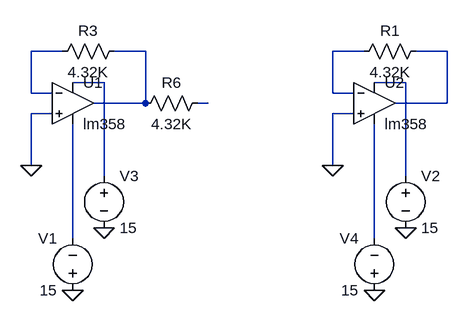
[diagram p0: schematic Inverting_Adder_and_Buffer_Amplifier.asc]
Inverting_Adder_and_Buffer_Amplifier.asc, the LTspice schematic file:
Version 4
SHEET 1 880 680
WIRE 64 -112 16 -112
WIRE 192 -112 144 -112
WIRE 528 -112 480 -112
WIRE 656 -112 608 -112
WIRE 128 -64 80 -64
WIRE 592 -64 544 -64
WIRE 16 -48 16 -112
WIRE 48 -48 16 -48
WIRE 480 -48 480 -112
WIRE 512 -48 480 -48
WIRE 192 -32 192 -112
WIRE 192 -32 112 -32
WIRE 288 -32 272 -32
WIRE 656 -32 656 -112
WIRE 656 -32 576 -32
WIRE 48 -16 16 -16
WIRE 512 -16 480 -16
WIRE 16 64 16 -16
WIRE 480 64 480 -16
WIRE 128 80 128 -64
WIRE 592 80 592 -64
WIRE 80 176 80 0
WIRE 544 176 544 0
FLAG 16 64 0
FLAG 80 256 0
FLAG 128 160 0
FLAG 480 64 0
FLAG 544 256 0
FLAG 592 160 0
SYMBOL OpAmps\\lm358 80 -96 R0
SYMATTR InstName U1
SYMBOL res 160 -128 R90
WINDOW 0 0 56 VBottom 2
WINDOW 3 32 56 VTop 2
SYMATTR InstName R3
SYMATTR Value 4.32K
SYMATTR SpiceLine tol=1 pwr=0.1
SYMBOL voltage 128 64 R0
WINDOW 123 0 0 Left 0
WINDOW 39 0 0 Left 0
SYMATTR InstName V3
SYMATTR Value 15
SYMBOL res 288 -48 R90
WINDOW 0 0 56 VBottom 2
WINDOW 3 32 56 VTop 2
SYMATTR InstName R6
SYMATTR Value 4.32K
SYMATTR SpiceLine tol=1 pwr=0.1
SYMBOL voltage 80 272 R180
WINDOW 0 24 96 Left 2
WINDOW 3 24 16 Left 2
WINDOW 123 0 0 Left 0
WINDOW 39 0 0 Left 0
SYMATTR InstName V1
SYMATTR Value 15
SYMBOL OpAmps\\lm358 544 -96 R0
SYMATTR InstName U2
SYMBOL res 624 -128 R90
WINDOW 0 0 56 VBottom 2
WINDOW 3 32 56 VTop 2
SYMATTR InstName R1
SYMATTR Value 4.32K
SYMATTR SpiceLine tol=1 pwr=0.1
SYMBOL voltage 592 64 R0
WINDOW 123 0 0 Left 0
WINDOW 39 0 0 Left 0
SYMATTR InstName V2
SYMATTR Value 15
SYMBOL voltage 544 272 R180
WINDOW 0 24 96 Left 2
WINDOW 3 24 16 Left 2
WINDOW 123 0 0 Left 0
WINDOW 39 0 0 Left 0
SYMATTR InstName V4
SYMATTR Value 15

The netlist it stands for:
* Inverting_Adder_and_Buffer_Amplifier.asc
XU1 0 N001 N005 N008 N002 lm358  ; pins In+ In- V+ V- OUT
R3 N002 N001 4.32K tol=1 pwr=0.1
V3 N005 0 15
R6 N007 N002 4.32K tol=1 pwr=0.1
V1 0 N008 15
XU2 0 N003 N006 N009 N004 lm358  ; pins In+ In- V+ V- OUT
R1 N004 N003 4.32K tol=1 pwr=0.1
V2 N006 0 15
V4 0 N009 15
.backanno
.end